# EAGLE design Adafruit INA228 I2C Power Monitor (EAGLE 9.6.2)
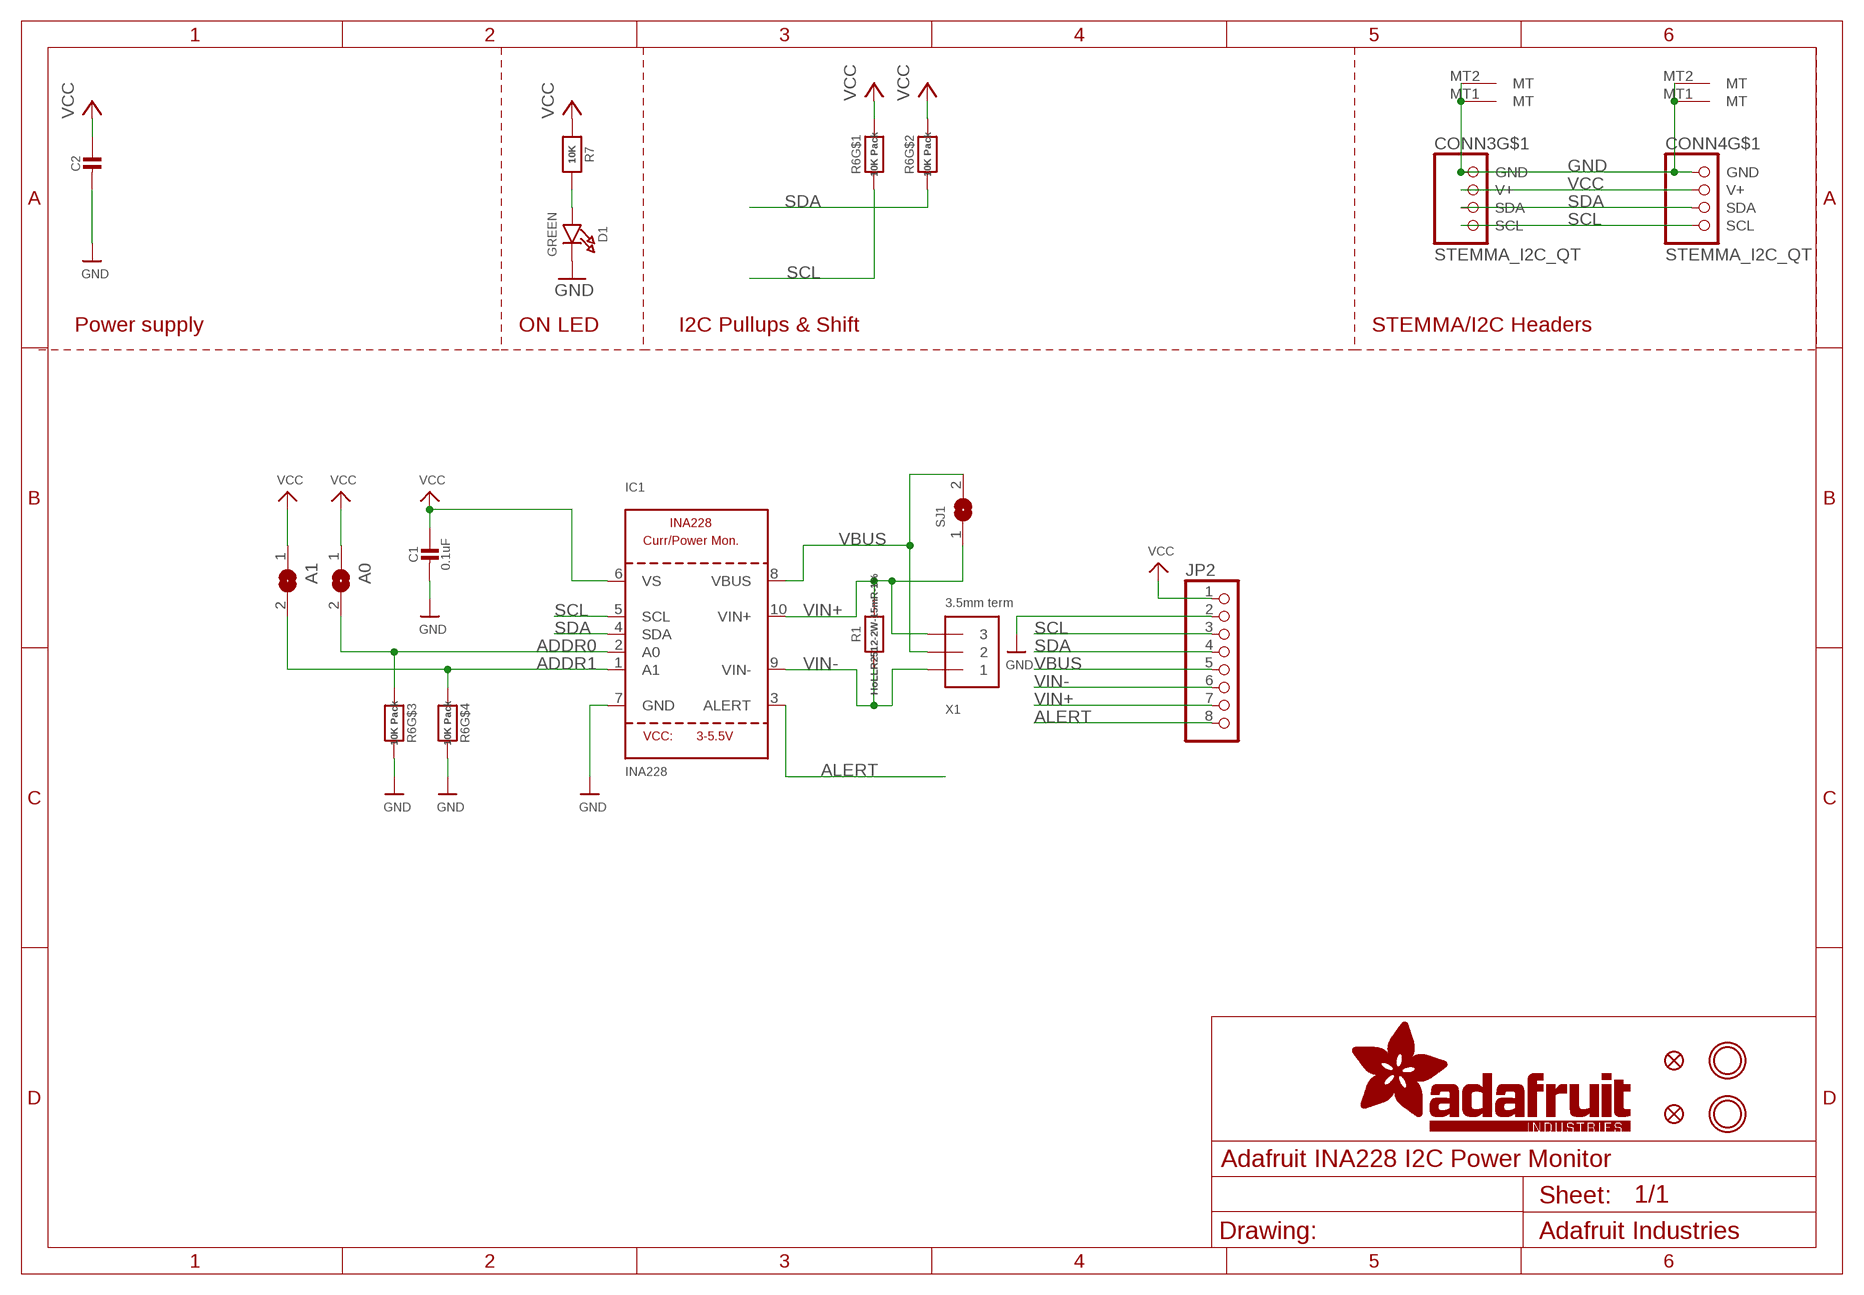
[diagram p0: schematic, sheet 1]

## Parts
A0  SOLDERJUMPERREFLOW_NOPASTE  [SOLDERJUMPER_REFLOW_NOPASTE]
A1  SOLDERJUMPERREFLOW_NOPASTE  [SOLDERJUMPER_REFLOW_NOPASTE]
C1  0.1uF  CAP_CERAMIC0603_NO  [0603-NO]
C2  10uF  CAP_CERAMIC0805-NOOUTLINE  [0805-NO]
CONN3  STEMMA_I2C_QT  [JST_SH4]
CONN4  STEMMA_I2C_QT  [JST_SH4]
D1  GREEN  LED0603_NOOUTLINE  [CHIPLED_0603_NOOUTLINE]
FID3  FIDUCIAL_1MM  [FIDUCIAL_1MM]
FID4  FIDUCIAL_1MM  [FIDUCIAL_1MM]
IC1  INA228  [MSOP10]
JP2  HEADER-1X870MIL  [1X08_ROUND_70]
R1  HoLLR2512-2W-15mR-1%  RESISTOR2512  [2512]
R6  10K Pack  RESISTOR_4PACK  [RESPACK_4X0603]
R7  10K  RESISTOR_0603_NOOUT  [0603-NO]
SJ1  SOLDERJUMPER  [SOLDERJUMPER_ARROW_NOPASTE]
U$20  MOUNTINGHOLE2.5  [MOUNTINGHOLE_2.5_PLATED]
U$21  MOUNTINGHOLE2.5  [MOUNTINGHOLE_2.5_PLATED]
X1  3.5mm term  TERMBLOCK_1X3  [TERMBLOCK_1X3-3.5MM]

## Nets
ADDR0: A0.2 IC1.2(A0) R6.3
ADDR1: A1.2 IC1.1(A1) R6.4
ALERT: IC1.3(ALERT) JP2.8
GND: C1.2 C2.2 CONN3.1(GND) CONN3.MT1(MT) CONN3.MT2(MT) CONN4.1(GND) CONN4.MT1(MT) CONN4.MT2(MT) D1.C IC1.7(GND) JP2.2 R6.5 R6.6
N$3: D1.A R7.2
SCL: CONN3.4(SCL) CONN4.4(SCL) IC1.5(SCL) JP2.3 R6.1
SDA: CONN3.3(SDA) CONN4.3(SDA) IC1.4(SDA) JP2.4 R6.2
VBUS: IC1.8(VBUS) JP2.5 SJ1.2 X1.2
VCC: A0.1 A1.1 C1.1 C2.1 CONN3.2(V+) CONN4.2(V+) IC1.6(VS) JP2.1 R6.7 R6.8 R7.1
VIN+: IC1.10(VIN+) JP2.7 R1.2 SJ1.1 X1.3
VIN-: IC1.9(VIN-) JP2.6 R1.1 X1.1

## Notes on the sheet
- Power supply | ON LED | I2C Pullups & Shift | STEMMA/I2C Headers

## Library data of the parts
A0 A1 = microbuilder:SOLDERJUMPER: SMD Solder JUMPER Solder the two pads together to create a connection, or remove the solder to break it. REFLOW - Use this footprint for solder paste and reflow ovens. WAVE - Use this footprint for hand-soldering (larger pads). CLOSED - Has a trace between the two pads to ensure it is closed by default. The trace needs to be cut to disable the jumper, and can be closed again by creating a solder bridge between the two pads.
C1 C2 = microbuilder:CAP_CERAMIC: Ceramic Capacitors For new designs, use the packages preceded by an '_' character since they are more reliable: The following footprints should be used on most boards: _0402 - Standard footprint for regular board layouts _0603 - Standard footprint for regular board layouts _0805 - Standard footprint for regular board layouts _1206 - Standard footprint for regular board layouts For extremely tight-pitch boards where space is at a premium, the following 'micro-pitch' footprints can be used (smaller pads, no silkscreen outline, etc.): _0402MP - Micro-pitch footprint for very dense/compact boards _0603MP - Micro-pitch footprint for very dense/compact boards _0805MP - Micro-pitch footprint for very dense/compact boards _1206MP - Micro-pitch footprint for very dense/compact boards
CONN3 CONN4 = adafruit_electromech:STEMMA_I2C; LCSC: C2845363
D1 = microbuilder:LED: LED 0603 - 0603 Surface Mount Package 2mA: Green LED - Low Power (3.9mcd, 2ma, 1.7Vf) - Digikey: 475-2709-2-ND Orange LED - Low Power (9.8mcd, 2ma, 1.8Vf) - Digikey: 475-1194-2-ND Red LED - Low Power (5mcd, 2ma, 1.8Vf) - Digikey: 475-1195-2-ND Yellow LED - Low Power (7mcd, 2ma, 1.8Vf) - Digikey: 475-1196-2-ND 5mA: Blue LED - Low Power (17mcd, 5ma, 2.9Vf) - Digikey: LNJ937W8CRACT-ND 0805 - 0805 Surface Mount Package 2mA: Red LED (8.8mcd, 2mA, 1.8Vf, Clear) - Low Power [Digikey: 475-2510-1-ND] Green LED (5mcd, 2mA, 1.8Vf, Clear) - Low Power [Digikey: 475-2730-1-ND] Yellow LED (11.3mcd, 2mA, 1.8Vf, Clear) - Low Power [Digikey: 475-2555-1-ND] 20mA: Red LED (104mcd, 20mA, Diffused) - LS R976 [Digikey: 475-1278-6-ND] Red LED (12mcd, 20mA, 2.0Vf, Clear) - APT2012EC [Digikey: 754-1128-1-ND] Green LED (15mcd, 20mA, 2.2Vf, Clear) - APT2012GC [Digikey: 754-1131-1-ND] Orange LED (160mcd, 20mA, 2.1Vf, Clear) - APT2012SECK [Digikey: 754-1130-1-ND] 1206 - 1206 Surface Mount Package Green LED (26mcd, 20mA, Diffused) - LG N971 [Digikey: 475-1407-6-ND] Red LED (15mcd, 20mA, Diffused) - LH N974 [Digikey: 475-1416-6-ND] Cree - Cree High-Power Surface Mount LEDs XPEBWT-L1-0000-00D50 - White 111lm 350mA 2.9Vf 6200K 110° XTEAWT-00-0000-00000LEE3 - White 114lm 350mA 2.85Vf 5000K 115° Everlight - Everlight 45-21 Series Surface Mount LEDs 45-21/QK2C-B2832AC2CB2/2T - Warm White 2000mcd 20mA 3.25Vf 3050K 120° 45-21/LK2C-B38452C4CB2/2T - Nuetral White 2000mcd 20mA 3.25Vf 4150K 120° 45-21/LK2C-B50634C6CB2/2T - Cold White 2200mcd 20mA 3.25Vf 5650K 120° PLCC2 Reverse Mount LS T77K-J1L2-1-0-2-R18-Z - Red 11.25mcd 2mA 1.8Vf 630nm 120° LO T77K-L1M2-24-Z - Orange 19.6mcd 2mA 1.8Vf 606nm 120° LY T77K-K2M1-26-Z - Yellow 15.7mcd 2mA 1.8Vf 587nm 120°; ROT: 270
FID3 FID4 = microbuilder:FIDUCIAL: Fiducial Alignment Points Various fiducial points for machine vision alignment.; BOM: EXCLUDE
IC1 = adafruit_sensor:INA228
JP2 = microbuilder:HEADER-1X8: PIN HEADER
R1 R7 = microbuilder:RESISTOR: Resistors For new designs, use the packages preceded by an '_' character since they are more reliable: The following footprints should be used on most boards: _0402 - Standard footprint for regular board layouts _0603 - Standard footprint for regular board layouts _0805 - Standard footprint for regular board layouts _1206 - Standard footprint for regular board layouts For extremely tight-pitch boards where space is at a premium, the following 'micro-pitch' footprints can be used (smaller pads, no silkscreen outline, etc.): _0402MP - Micro-pitch footprint for very dense/compact boards _0603MP - Micro-pitch footprint for very dense/compact boards _0805MP - Micro-pitch footprint for very dense/compact boards _1206MP - Micro-pitch footprint for very dense/compact boards
R6 = microbuilder:RESISTOR_4PACK: Resistor Packs (4 resistors) 4 x 0603 10K 1/16W - Digikey: YC164J-10KCT-ND
SJ1 = microbuilder:SOLDERJUMPER: SMD Solder JUMPER Solder the two pads together to create a connection, or remove the solder to break it. REFLOW - Use this footprint for solder paste and reflow ovens. WAVE - Use this footprint for hand-soldering (larger pads). CLOSED - Has a trace between the two pads to ensure it is closed by default. The trace needs to be cut to disable the jumper, and can be closed again by creating a solder bridge between the two pads.; BOM: EXCLUDE
U$20 U$21 = adafruit_electromech:MOUNTINGHOLE: Mounting Hole For #2 screws (0.086"/2.18mm width, 0.094"/2.4mm hole) use 2.5mm; BOM: EXCLUDE
X1 = adafruit_electromech:TERMBLOCK_1X3: 3.5mm Terminal block http://www.ladyada.net/library/pcb/eaglelibrary.html

## Net classes
1 highpower: width 0.305 mm, drill 0.483 mm
2 lowpower: width 0.254 mm, drill 0.483 mm

## Board
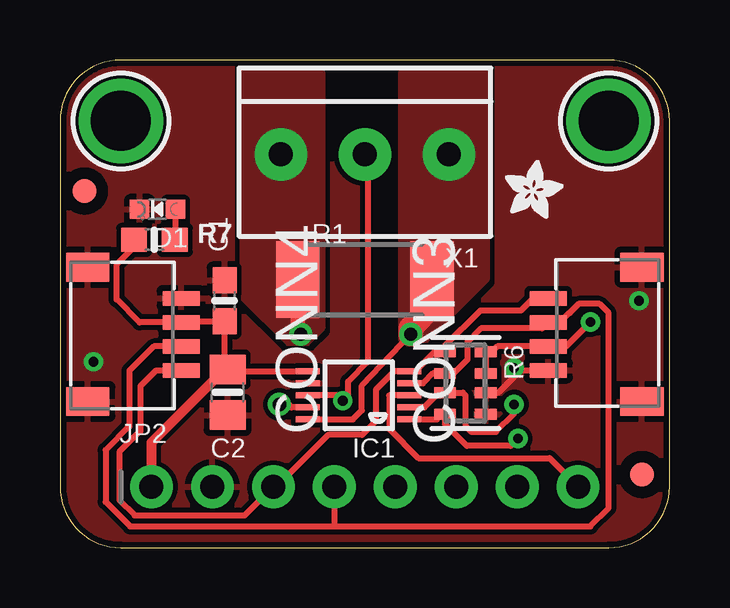
[diagram p1: board, top side]
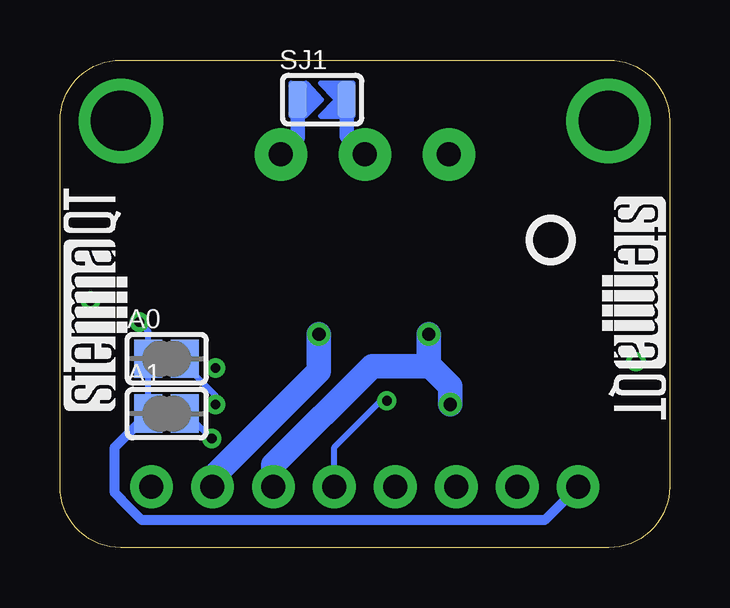
[diagram p2: board, bottom side, seen from below]

Size 25.4 x 20.32 mm. Coordinates in mm from the lower left corner, seen from the top.
Outline: 0,17.78 0,2.54 arc90 2.54,0 22.86,0 arc90 25.4,2.54 25.4,17.78 arc90 22.86,20.32 2.54,20.32 arc90 0,17.78
Copper layers (1*16): Top 0.035mm / dielectric 1.5mm / Bottom 0.035mm
Design rules "adafruit 7-7": minimum track width 6mil, minimum drill 15.5mil, track to track 8mil, track to pad 7mil, pad to pad 7mil, via to via 7mil, smd to smd 7mil, copper to edge 10mil, drill to drill 8mil, minimum pad ring 10mil, minimum via ring 8mil, stop-mask expansion 2mil, vias tented up to drill 20mil, thermal gap 10mil
bRestrict: area 10.2,2.5 to 10.3,3

### Footprints (pad centres in the part's own frame; a part is rotated, then mirrored left to right if it is on the bottom)
SOLDERJUMPER_REFLOW_NOPASTE = smd 1.168 x 1.6: 1 -0.762,0; 2 0.762,0
0603-NO = smd 1.075 x 1: 1 -0.85,0; 2 0.85,0
0805-NO = smd 1.24 x 1.5: 1 -0.95,0; 2 0.95,0
JST_SH4 = smd 0.6 x 1.55: 1 -1.5,2.006; 2 -0.5,2.006; 3 0.5,2.006; 4 1.5,2.006 | smd 1.2 x 1.8: MT1 -2.8,-1.894; MT2 2.8,-1.894
CHIPLED_0603_NOOUTLINE = smd 0.8 x 0.8: A 0,-0.75; C 0,0.75
FIDUCIAL_1MM = smd 1 x 1: 1 0,0
MSOP10 = smd 0.25 x 1: 1 -1,-2.113; 2 -0.5,-2.113; 3 0,-2.113; 4 0.5,-2.113; 5 1,-2.113; 6 1,2.113; 7 0.5,2.113; 8 0,2.113; 9 -0.5,2.113; 10 -1,2.113
1X08_ROUND_70 = drill 1 pad 1.778: 1 -8.89,0; 2 -6.35,0; 3 -3.81,0; 4 -1.27,0; 5 1.27,0; 6 3.81,0; 7 6.35,0; 8 8.89,0
2512 = smd 1.8 x 3.2: 1 -2.8,0; 2 2.8,0
RESPACK_4X0603 = smd 0.45 x 0.9: 1 -1.3,-0.85; 2 -0.4,-0.85; 3 0.4,-0.85; 4 1.3,-0.85; 5 1.3,0.85; 6 0.4,0.85; 7 -0.4,0.85; 8 -1.3,0.85
SOLDERJUMPER_ARROW_NOPASTE = smd 0.762 x 1.524: 1 -1.016,0; 2 1.016,0
MOUNTINGHOLE_2.5_PLATED = drill 2.5 pad 3.2: P$1 0,0
TERMBLOCK_1X3-3.5MM = drill 1 pad 2.184: 1 3.5,0; 2 0,0; 3 -3.5,0

### Placement (x,y rotation side)
A0  20.95,7.87 0 bottom
A1  20.95,5.59 0 bottom
C1  6.86,10.29 90 top
C2  6.99,6.48 270 top
CONN3  22.35,8.89 90 top
CONN4  3.05,8.89 270 top
D1  4.06,14.1 90 top
FID3  1.02,14.86 0 top
FID4  24.26,3.05 0 top
IC1  12.45,6.35 90 top
JP2  12.7,2.54 0 top
PLABEL0  [PLABEL0]  6.48,18.03 90 top
PLABEL1  [PLABEL1]  19.06,18.12 90 top
PLABEL2  [PLABEL2]  3.94,4.06 0 top
PLABEL3  [PLABEL3]  6.35,0.89 0 top
PLABEL4  [PLABEL4]  9.02,4.19 0 top
PLABEL5  [PLABEL5]  11.56,0.89 0 top
PLABEL6  [PLABEL6]  16.89,0.89 0 top
PLABEL7  [PLABEL7]  19.3,4.06 0 top
PLABEL8  [PLABEL8]  3.3,14.86 0 top
PLABEL9  [PLABEL9]  14.22,4.06 0 top
PLABEL10  [PLABEL10]  21.97,1.02 0 top
PLABEL11  [PLABEL11]  12.7,12.19 0 bottom
PLABEL12  [PLABEL12]  23.62,4 0 bottom
PLABEL13  [PLABEL13]  10.41,6.1 0 bottom
PLABEL14  [PLABEL14]  12.7,0.89 0 bottom
PLABEL15  [PLABEL15]  18.41,6.99 90 bottom
PLABEL16  [PLABEL16]  18.29,4.83 90 bottom
PLABEL17  [PLABEL17]  12.7,10.16 0 bottom
PLABEL18  [PLABEL18]  6.99,16.51 0 bottom
PLABEL19  [PLABEL19]  18.54,16.38 0 bottom
PLABEL20  [PLABEL20]  12.83,14.48 0 bottom
R1  12.7,11.18 0 top
R6  16.89,6.86 270 top
R7  3.94,12.83 0 top
SJ1  14.48,18.67 0 bottom
U$1  [ADAFRUIT_2.5MM]  18.54,13.72 0 top
U$20  2.54,17.78 0 top
U$21  22.86,17.78 0 top
U$30  [PCBFEAT-REV-040]  4.95,12.83 0 bottom
U$31  [STEMMAQT]  22.61,5.71 90 bottom
U$32  [STEMMAQT]  2.79,14.61 270 bottom
X1  12.7,16.38 180 top

### Tracks (layer width: path | path; a pad name or v marks a point on that pad's centre or on a via)
ADDR0  (via drill 0.4)
  Top 0.254: IC1.2 15.18,5.85 15.79,6.46 R6.3 16.78,6.46 16.89,6.35 16.89,5.08 17.14,4.83 18.16,4.83 18.92,5.59 v18.92,5.97
  Bottom 0.254: v18.92,5.97 18.92,6.35 20.19,7.62 A0.2
ADDR1  (via drill 0.4)
  Top 0.254: IC1.1 15.7,5.35 15.91,5.56 R6.4 16.04,5.16 16.96,4.24 18.78,4.24 v19.08,4.54
  Bottom 0.254: v19.08,4.54 20.12,5.59 A1.2
ALERT
  Top 0.254: IC1.3 13.72,6.35 13.72,4.95 14.94,3.73 20.4,3.73 JP2.8
GND  (via drill 0.4)
  Top 0.254: R6.6 18.27,6.46 19.05,7.24 19.05,7.37 19.81,7.37 CONN3.1
  other vias: 1.4,7.75 24.13,10.29 18.92,7.49
  pour Top (rank 4): 0,20.32 25.4,20.32 25.4,0 0,0
N$3
  Top 0.254: R7.2 4.81,12.83 D1.A
SCL
  Top 0.254: CONN3.4 19.71,10.39 19.2,9.88 17.51,9.88 16.04,8.41 R6.1 15.62,8.16 14.81,7.35 IC1.5 13.92,7.35 13.16,6.59 13.16,5.28 12.59,4.7 11.18,4.7 8.89,2.41 JP2.3 7.7,1.35 3.11,1.35 2.48,1.98 2.48,3.99 3.35,4.87 3.35,6.73 4.01,7.39 CONN4.4
SDA
  Top 0.254: IC1.4 15.12,6.85 15.53,7.26 R6.2 16.4,7.26 16.99,7.84 16.99,8.58 17.54,9.14 20.09,9.14 CONN3.3 20.38,9.42 20.85,9.42 21.21,9.79 21.25,9.79 21.62,10.16 22.48,10.16 22.86,9.78 22.86,1.65 22.1,0.89 11.43,0.89 | 11.43,0.89 2.92,0.89 1.91,1.91 1.91,4.06 2.9,5.05 2.9,7.37 3.91,8.39 CONN4.3 | JP2.4 11.43,0.89
VBUS  (via drill 0.4)
  Top 0.254: IC1.8 11.56,6.35 v11.78,6.12 12,6.34 12,6.92 12.83,7.75 12.83,16.26 X1.2
  Bottom 0.254: JP2.5 13.97,4.19 11.91,6.25 v11.78,6.12
  Bottom 0.61: SJ1.2 13.46,17.14 X1.2
VCC  (via drill 0.4)
  Top 0.254: R6.7 R6.8 18,8.16 18.23,8.39 CONN3.2 21.09,8.39 v22.1,9.4 | IC1.6 7.24,7.35 7.16,7.43 C2.1 | 6.6,9.44 5.1,9.44 CONN4.2 3.31,9.39 2.36,10.34 2.36,11.81 3.09,12.54 R7.1 | 6.6,9.44 C1.1 | 6.6,9.44 6.87,9.17 6.87,7.54 C2.1 | C2.1 6.51,6.95 6.38,6.95
  Top 0.406: 6.38,6.95 3.81,4.38 JP2.1
  Bottom 0.254: A1.1 A0.1 21.72,9.02 v22.1,9.4
  Bottom 0.406: JP2.1 5.21,1.14 21.99,1.14 22.86,2.01 22.86,2.03 23.11,2.29 23.11,4.19 A1.1
VIN+  (via drill 0.55)
  Top 0.254: IC1.10 12.21,5.35 12.58,5.72 12.58,6.75 v14.61,8.89 | R1.2 15.58,10.16
  Top 1.016: 15.58,10.16 14.61,9.14 v14.61,8.89
  Bottom 0.61: SJ1.1 15.49,17.09 X1.3
  Bottom 1.016: JP2.7 19.05,2.92 14.61,7.36 v14.61,8.89
  pour Top (no thermals): 14.48,20.07 17.78,20.07 17.78,11.18 15.24,8.64 14.22,8.64 14.22,19.81
VIN-  (via drill 0.55)
  Top 0.254: IC1.9 9.64,5.85 9.53,5.97 v9.14,5.97
  Top 0.61: R1.1 9.9,9.02 v10.03,8.89
  Bottom 0.406: 10.03,7.57 9.98,7.57
  Bottom 1.016: JP2.6 16.51,3.46 12.4,7.57 10.03,7.57 v10.03,8.89 | v9.14,5.97 9.14,6.73 9.98,7.57
  pour Top (no thermals): 7.62,10.41 7.62,20.07 10.67,20.07 10.92,19.81 10.92,9.14 10.29,8.51 9.53,8.51

### Text on the board
Pinguin_tBackup: Vin- | Vin+ | on | VIN | SCL | VBUS | VIN+ | GND | SDA | VIN- | ALRT
Pinguin_bBackup: V- | V+ | VBus | INA228 | DC Current Monitor | A0 | Max Bus V: 0-85V / Max Curr: ±10A / I2C Addr 0x40 | A1 | Addr | VLogic/Vcc: 3-5VDC